# Altium project Voiture-Supercapa.PrjPcb
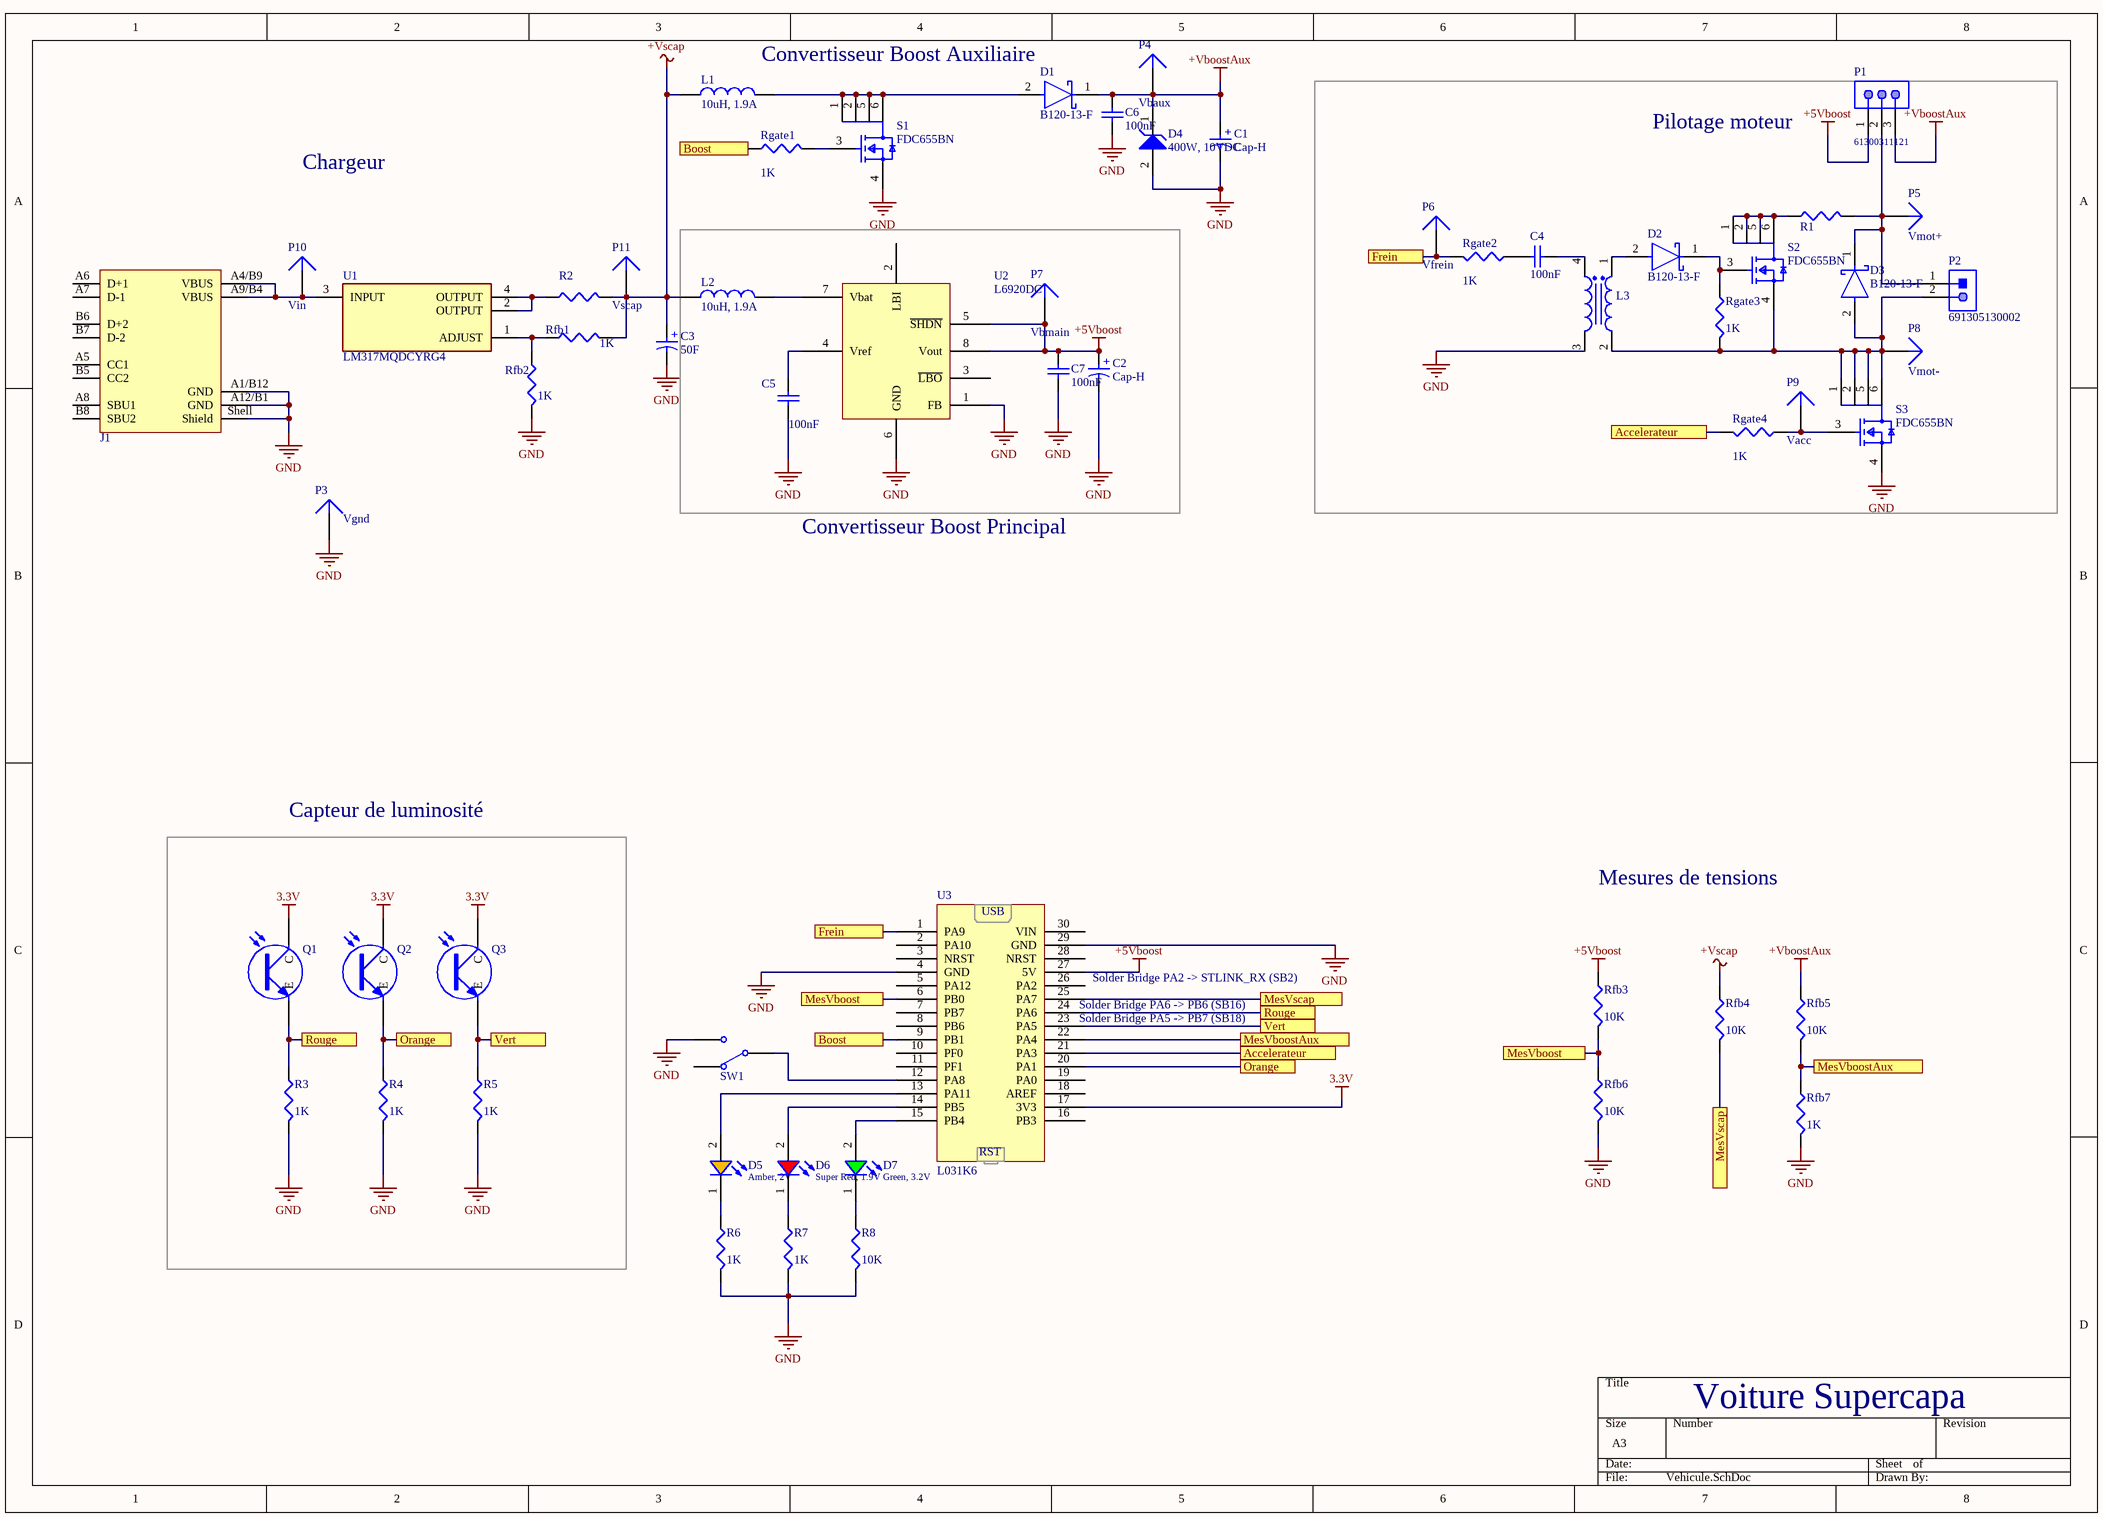
[diagram p0: Vehicule.SchDoc]
1 sheet, 58 parts. Net scope: flat (ports and power ports of the same name join across sheets).
Board file: Vehicule.PcbDoc

## Sheet Vehicule.SchDoc
size A3; SheetNumber: 1; SheetTotal: 1

### Parts
C1  Cap-H  [CAP-8x20]
C2  Cap-H  [CAP-8x20]
C3  50F  [SuperCap Couchee]
C4  100nF  [WCAP-CSGP_0805_L2W1.25H0.8_Reflow]
C5  100nF  [WCAP-CSGP_0805_L2W1.25H0.8_Reflow]
C6  100nF  [WCAP-CSGP_0805_L2W1.25H0.8_Reflow]
C7  100nF  [WCAP-CSGP_0805_L2W1.25H0.8_Reflow]
D1  B120-13-F  [FP-SMA-MFG]
D2  B120-13-F  [FP-SMA-MFG]
D3  B120-13-F  [FP-SMA-MFG]
D4  400W, 10VDC  [WE-TVSP_DO-214AC_Unidirectional]
D5  Amber, 2V  [WL-SMCW_0805]
D6  Super Red, 1.9V  [WL-SMCW_0805]
D7  Green, 3.2V  [WL-SMCW_0805]
J1  629722000214  [629722000214]  (value not drawn)
L1  10uH, 1.9A  [WE-PD_6033R]
L2  10uH, 1.9A  [WE-PD_6033R]
L3  10µH / 90µH  [WE-MTCI_5030]  (value not drawn)
P1  61300311121  [61300311121]
P2  691305130002  [691305130002]
P3  Vgnd  [PIN1]
P4  Vbaux  [PIN1]
P5  Vmot+  [PIN1]
P6  Vfrein  [PIN1]
P7  Vbmain  [PIN1]
P8  Vmot-  [PIN1]
P9  Vacc  [PIN1]
P10  Vin  [PIN1]
P11  Vscap  [PIN1]
Q1  1540032NA3090  [WL-TTRW_D3.85H5.3]  (value not drawn)
Q2  1540032NA3090  [WL-TTRW_D3.85H5.3]  (value not drawn)
Q3  1540032NA3090  [WL-TTRW_D3.85H5.3]  (value not drawn)
R1  3.3Ω  [WRIS-KSKE_2512_L6.3W3.2H0.6]  (value not drawn)
R2  3.3Ω  [WRIS-KSKE_2512_L6.3W3.2H0.6]  (value not drawn)
R3  value 1K  [R0805]  (hidden comment: RESISTOR 805)
R4  value 1K  [R0805]  (hidden comment: RESISTOR 805)
R5  value 1K  [R0805]  (hidden comment: RESISTOR 805)
R6  value 1K  [R0805]  (hidden comment: RESISTOR 805)
R7  value 1K  [R0805]  (hidden comment: RESISTOR 805)
R8  value 10K  [R0805]  (hidden comment: RESISTOR 805)
Rfb1  value 1K  [R0805]  (hidden comment: RESISTOR 805)
Rfb2  value 1K  [R0805]  (hidden comment: RESISTOR 805)
Rfb3  value 10K  [R0805]  (hidden comment: RESISTOR 805)
Rfb4  value 10K  [R0805]  (hidden comment: RESISTOR 805)
Rfb5  value 10K  [R0805]  (hidden comment: RESISTOR 805)
Rfb6  value 10K  [R0805]  (hidden comment: RESISTOR 805)
Rfb7  value 1K  [R0805]  (hidden comment: RESISTOR 805)
Rgate1  value 1K  [R0805]  (hidden comment: RESISTOR 805)
Rgate2  value 1K  [R0805]  (hidden comment: RESISTOR 805)
Rgate3  value 1K  [R0805]  (hidden comment: RESISTOR 805)
Rgate4  value 1K  [R0805]  (hidden comment: RESISTOR 805)
S1  FDC655BN  [FP-419BL-MFG]
S2  FDC655BN  [FP-419BL-MFG]
S3  FDC655BN  [FP-419BL-MFG]
SW1  450404015514  [450404015514]  (value not drawn)
U1  LM317MQDCYRG4  [FP-DCY0004A-IPC_B]
U2  L6920DC  [TSOP65P500X110-8N]
U3  L031K6  [STM-Nano]

### Blocks framed on the sheet
Pilotage moteur: C4 D2 D3 L3 P1 P2 P5 P6 P8 P9 R1 Rgate2-Rgate4 S2 S3
Capteur de luminosité: Q1-Q3 R3-R5

### Ports
Accelerateur, Boost, Frein, MesVboost, MesVboostAux, MesVscap, Orange, Rouge, Vert

### Nets
3.3V: Q1.1(C) Q2.1(C) Q3.1(C) U3.17(3V3)
+5Vboost: C2.1(P) C7.1 P1.1 P7.1 Rfb3.1 U2.5(~{SHDN}) U2.8(Vout) U3.27(5V)
+VboostAux: C1.1(P) C6.1 D1.1(C) D4.1(K) P1.3 P4.1 Rfb5.1
+Vscap: C3.1(P) L1.1 L2.1 P11.1 R2.2 Rfb1.2 Rfb4.1
GND: C1.2(N) C2.2(N) C3.2(N) C5.1 C6.2 C7.2 D4.2(A) J1.A1/B12(GND) J1.A12/B1(GND) J1.Shell(Shield) L3.3 P3.1 R3.2 R4.2 R5.2 R6.2 R7.2 R8.2 Rfb2.2 Rfb6.2 Rfb7.2 S1.4(S) S3.4(S) SW1.L2 U2.1(FB) U2.6(GND) U3.4(GND) U3.29(GND)
NetC4_1: C4.1 L3.4
NetC4_2: C4.2 Rgate2.1
NetC5_2: C5.2 U2.4(Vref)
NetD1_2: D1.2(A) L1.2 S1.1(D) S1.2(D) S1.5(D) S1.6(D)
NetD2_1: D2.1(C) Rgate3.1 S2.3(G)
NetD2_2: D2.2(A) L3.1
NetD3_1: D3.1(C) P1.2 P2.1 P5.1 R1.2
NetD3_2: D3.2(A) L3.2 P2.2 P8.1 Rgate3.2 S2.4(S) S3.1(D) S3.2(D) S3.5(D) S3.6(D)
NetD5_1: D5.1(K) R6.1
NetD5_2: D5.2(A) U3.13(PA11)
NetD6_1: D6.1(K) R7.1
NetD6_2: D6.2(A) U3.14(PB5)
NetD7_1: D7.1(K) R8.1
NetD7_2: D7.2(A) U3.15(PB4)
NetJ1_A4/B9: J1.A4/B9(VBUS) J1.A9/B4(VBUS) P10.1 U1.3(INPUT)
NetL2_2: L2.2 U2.7(Vbat)
NetP6_1: P6.1 Rgate2.2 U3.1(PA9) ; port Frein
NetP9_1: P9.1 Rgate4.1 S3.3(G)
NetQ1_2: Q1.2(E) R3.1 U3.24(PA6) ; port Rouge
NetQ2_2: Q2.2(E) R4.1 U3.20(PA1) ; port Orange
NetQ3_2: Q3.2(E) R5.1 U3.23(PA5) ; port Vert
NetR1_1: R1.1 S2.1(D) S2.2(D) S2.5(D) S2.6(D)
NetR2_1: R2.1 U1.2(OUTPUT) U1.4(OUTPUT)
NetRfb1_1: Rfb1.1 Rfb2.1 U1.1(ADJUST)
NetRfb3_2: Rfb3.2 Rfb6.1 U3.6(PB0) ; port MesVboost
NetRfb4_2: Rfb4.2 U3.25(PA7) ; port MesVscap
NetRfb5_2: Rfb5.2 Rfb7.1 U3.22(PA4) ; port MesVboostAux
NetRgate1_1: Rgate1.1 U3.9(PB1) ; port Boost
NetRgate1_2: Rgate1.2 S1.3(G)
NetRgate4_2: Rgate4.2 U3.21(PA3) ; port Accelerateur
NetSW1_COM: SW1.COM U3.12(PA8)

Not connected (* = marked no-connect by the designer): J1 A5(CC1) A6(D+1) A7(D-1) A8(SBU1) B5(CC2) B6(D+2) B7(D-2) B8(SBU2); SW1 L1; U2 2(LBI) 3(~{LBO}); U3 2(PA10) 3(NRST) 5(PA12) 7(PB7) 8(PB6) 10(PF0) 11(PF1) 16(PB3) 18(AREF) 19(PA0) 26(PA2) 28(NRST) 30(VIN)

### Notes on the sheet
- Convertisseur Boost Auxiliaire
- Chargeur
- Convertisseur Boost Principal
- Mesures de tensions
- (near U3) Solder Bridge PA2 -> STLINK_RX (SB2)
- (near U3) Solder Bridge PA6 -> PB6 (SB16)
- (near U3) Solder Bridge PA5 -> PB7 (SB18)
- Voiture Supercapa
- (in symbol 850617022002) +
- (in symbol CAP-WE-8X20H) +
- (in symbol STM32-NUCLEO-L031K6) USB; RST

### Library data of the parts
C1 C2 = CAP-WE-8X20H: Capacitor 8x20 H; Manufacturer Part Number: 850617022002; Manufacturer: Wurth Elektronik; Match Code: WCAP-STSC; Capacitance: 50F; Capacitance Tolerance: -10% / +30%; Discharge Current Max: 33.7A; Energy Density: 4.5Wh/kg; ESR (AC): 15mΩ; ESR (DC): 20mΩ; Leakage Current: 0.105mA; Pitch: 7.5mm; Power Density: 8.13kW/kg; Rated Discharge Current: 11.2A; Rated Voltage (DC): 2.7V; Category: Super Capacitors (EDLCs); ComponentLink1Description: Website Link; ComponentLink1URL: https://www.we-online.com/redexpert/article/850617022002?ad; ComponentLink2Description: Datasheet Link; ComponentLink2URL: https://www.we-online.com/redexpert/spec/850617022002?ad; Mount: Through Hole; Operating Temperature Max: 65°C; Operating Temperature Min: -40°C; Packaging: Bag; Height: 40mm; Diameter: 18mm; Life Cycle: 500000Cycles
C3 = 850617022002: WCAP-STSC Supercapacitors (EDLCs), THT, D18 x H40mm, 50F, 2.7VDC; Manufacturer: Wurth Elektronik; Capacitance Tolerance: -10% / +30%; Discharge Current Max: 33.7A; Energy Density: 4.5Wh/kg; ESR (AC): 15mΩ; ESR (DC): 20mΩ; Leakage Current: 0.105mA; Pitch: 7.5mm; Power Density: 8.13kW/kg; Rated Discharge Current: 11.2A; Rated Voltage (DC): 2.7V; Manufacturer Part Number: 850617022002; Category: Super Capacitors (EDLCs); Match Code: WCAP-STSC; ComponentLink1Description: Website Link; ComponentLink1URL: https://www.we-online.com/redexpert/article/850617022002?ad; ComponentLink2Description: Datasheet Link; ComponentLink2URL: https://www.we-online.com/redexpert/spec/850617022002?ad; Mount: Through Hole; Operating Temperature Max: 65°C; Operating Temperature Min: -40°C; Packaging: Bag; Height: 40mm; Diameter: 18mm; Capacitance: 50F; Life Cycle: 500000Cycles
C4 C6 C7 = 885012207072: WCAP-CSGP Multilayer Ceramic Chip Capacitor, General Purpose, size 0805, X7R, 100nF, 25VDC; Manufacturer: Wurth Elektronik; Case/Size Code: 0805; Capacitance: 470nF; Capacitance Tolerance: +/-10%; Dissipation Factor: 3.5%; Insulation Resistance: 5GΩ; Rated Voltage (DC): 25V; Technical Reference: X7R0805104K025DFCT10000; Manufacturer Part Number: 885012207072; Category: Multilayer Ceramic Chip Capacitors; Match Code: WCAP-CSGP; ComponentLink1Description: Website Link; ComponentLink1URL: https://www.we-online.com/redexpert/article/885012207072?ad; ComponentLink2Description: Datasheet Link; ComponentLink2URL: https://www.we-online.com/redexpert/spec/885012207072?ad; Mount: Surface Mount; Operating Temperature Max: 125°C; Operating Temperature Min: -55°C; Packaging: Tape and Reel; Length: 2mm; Width: 1.25mm; Height: 0.8mm; Ceramic Type: X7R
C5 = 885012207072: WCAP-CSGP Multilayer Ceramic Chip Capacitor, General Purpose, size 0805, X7R, 100nF, 25VDC; Manufacturer: Wurth Elektronik; Case/Size Code: 0805; Capacitance Tolerance: +/-10%; Dissipation Factor: 3.5%; Insulation Resistance: 5GΩ; Rated Voltage (DC): 25V; Technical Reference: X7R0805104K025DFCT10000; Manufacturer Part Number: 885012207072; Category: Multilayer Ceramic Chip Capacitors; Match Code: WCAP-CSGP; ComponentLink1Description: Website Link; ComponentLink1URL: https://www.we-online.com/redexpert/article/885012207072?ad; ComponentLink2Description: Datasheet Link; ComponentLink2URL: https://www.we-online.com/redexpert/spec/885012207072?ad; Mount: Surface Mount; Operating Temperature Max: 125°C; Operating Temperature Min: -55°C; Packaging: Tape and Reel; Length: 2mm; Width: 1.25mm; Height: 0.8mm; Capacitance: 100nF; Ceramic Type: X7R
D1-D3 = CMP-12790-000051-1: DIODE SCHOTTKY 20V 1A SMA; Manufacturer: Diodes Inc.; Value: 110pF; Standoff Height: 0.05mm; Max Junction Temp: +150°C; Max Surge Forward Current: 30A; Peak Reverse Current: 0.5mA; Height: 2.4mm; Temperature Range High: +150°C; Category: Diode; ComponentLink2Description: Datasheet; Forward Current: 1A; Device Class L1: Discrete Semiconductors; Footprint Url: https://www.diodes.com/assets/Package-Files/SMA.pdf; Device Class L3: Schottky Diodes; Reverse Voltage: 20V; Mouser Description: Schottky Diodes & Rectifiers 20V 1A; Temperature Range Low: -65°C; Automotive: No; Octopart: https://octopart.com/b120-13-f-diodes+inc.-40148653; Digikey Description: DIODE SCHOTTKY 20V 1A SMA; RoHS: TRUE; Lead Free: Yes; Manufacturer Part Number: B120-13-F; Package: SMA; Temperature: -65°C to +150°C; Capacitance: 110pF; Max Repetitive Reverse Voltage: 20V; ComponentLink2URL: https://www.diodes.com/assets/Datasheets/ds13002.pdf; Device Class L2: Diodes
D4 = 824500101: WE-TVSP SMT Power TVS Diode, DO-214AC, 400W, 10VDC, Unidirectional; Manufacturer: Wurth Elektronik; (Reverse) Breakdown Voltage: 11.7V; (Reverse) Peak Pulse Current: 23.5A; Clamping Voltage: 17V; DC Operating Voltage: 10V; ComponentLink1Description: Manufacturer; Mounting Technology: SMT; Operating Temperature: -65 to +150degC; Packaging: Tape and Reel; ComponentLink2URL: https://www.we-online.com/catalog/datasheet/824500101.pdf; ComponentLink2Description: Datasheet; Manufacturer Part Number: 824500101; Polarity: Unidirectional; ComponentLink1URL: http://www.we-online.de; Published Date: July 2020; Size: DO-214AC; Power Dissipation: 400W
D5 = 150080AS75000: WL-SMCW SMT Mono-color Chip LED Waterclear, size 0805, Amber, 2V, 140deg; Manufacturer: Wurth Elektronik; Chip Technology: AlInGaP; Dominant Wavelength typ.: 605nm; Luminous Intensity typ.: 130mcd; Peak Wavelength typ.: 610nm; Viewing Angle: 140deg; ComponentLink1Description: Manufacturer; ComponentLink1URL: http://www.we-online.de; ComponentLink2URL: https://www.we-online.com/catalog/datasheet/150080AS75000.pdf; ComponentLink2Description: Datasheet; Forward Voltage typ.: 2V; Emitting Color: Amber; Mounting Technology: SMT; Operating Temperature: -40 to +85degC; Published Date: December 2019; Part Number: 150080AS75000; Packaging: Tape and Reel; Size: 0805; Publisher: Wurth Elektronik; Manufacturer Part Number: 150080AS75000
D6 = 150080SS75000: WL-SMCW SMT Mono-color Chip LED Waterclear, size 0805, Super Red, 1.9V, 140deg; Manufacturer: Wurth Elektronik; Chip Technology: AlInGaP; Dominant Wavelength typ.: 630nm; Luminous Intensity typ.: 60mcd; Peak Wavelength typ.: 645nm; Viewing Angle: 140deg; ComponentLink1Description: Manufacturer; ComponentLink1URL: http://www.we-online.de; ComponentLink2URL: https://www.we-online.com/catalog/datasheet/150080SS75000.pdf; ComponentLink2Description: Datasheet; Forward Voltage typ.: 1.9V; Emitting Color: Super Red; Mounting Technology: SMT; Operating Temperature: -40 to +85degC; Published Date: December 2019; Part Number: 150080SS75000; Packaging: Tape and Reel; Size: 0805; Publisher: Wurth Elektronik; Manufacturer Part Number: 150080SS75000
D7 = 150080GS75000: WL-SMCW SMT Mono-color Chip LED Waterclear, size 0805, Green, 3.2V, 140deg; Manufacturer: Wurth Elektronik; Chip Technology: InGaN; Dominant Wavelength typ.: 525nm; Luminous Intensity typ.: 450mcd; Peak Wavelength typ.: 515nm; Viewing Angle: 140deg; ComponentLink1Description: Manufacturer; ComponentLink1URL: http://www.we-online.de; ComponentLink2URL: https://www.we-online.com/catalog/datasheet/150080GS75000.pdf; ComponentLink2Description: Datasheet; Forward Voltage typ.: 3.2V; Emitting Color: Green; Mounting Technology: SMT; Operating Temperature: -40 to +85degC; Published Date: December 2019; Part Number: 150080GS75000; Packaging: Tape and Reel; Size: 0805; Publisher: Wurth Elektronik; Manufacturer Part Number: 150080GS75000
J1 = 629722000214: WR-USB 2.0 Type C, Receptacle, Horizontal, SMT; Manufacturer: Wurth Elektronik; Interface Type: Type C; Number of Ports: 1; Rated Current: 5A; Working Voltage: 20VAC; ComponentLink1Description: Website Link; ComponentLink1URL: https://www.we-online.com/redexpert/article/629722000214?ad; ComponentLink2Description: Datasheet Link; ComponentLink2URL: https://www.we-online.com/redexpert/spec/629722000214?ad; Manufacturer Part Number: 629722000214; Category: Input/Output Connectors; Match Code: WR-USB; Mount: Surface Mount; Operating Temperature Max: 85°C; Operating Temperature Min: -40°C; Packaging: Tape and Reel; Application: USB 2.0; Gender: Receptacle; Number of Pins: 16; Orientation: Horizontal
L1 L2 = 744778510: WE-PD SMT Power Inductor, size 6033R, 10uH, 1.9A; Manufacturer: Wurth Elektronik; Self Resonant Frequency: 37MHz; DC Resistance typ.: 100mOhm; DC Resistance max.: 125mOhm; Saturation Current: 1.6A; Type: Robust; ComponentLink1Description: Manufacturer; ComponentLink1URL: http://www.we-online.de; ComponentLink2Description: Datasheet; ComponentLink2URL: https://www.we-online.com/catalog/datasheet/744778510.pdf; Mounting Technology: SMT; Operating Temperature: -40 to +125degC; Packaging: Tape and Reel; Published Date: April 2020; Inductance: 10uH; Manufacturer Part Number: 744778510; Rated Current: 1.9A; Size: 6033R
L3 = 744889030100: WE-MTCI SMT Multi-Turn Ratio coupled Inductor, size 5030, 1:3, 10µH / 90µH, 0.95A; Manufacturer: Wurth Elektronik; Case/Size Code: 5030; DC Resistance 1: 0.363Ω; DC Resistance 2: 0.846Ω; DC Resistance Max 1: 0.5Ω; DC Resistance Max 2: 1.1Ω; Rated Voltage: 80V; Saturation Current: 1.5A; Self Resonant Frequency: 8MHz; Manufacturer Part Number: 744889030100; Category: Coupled Power Inductors; Match Code: WE-MTCI; ComponentLink1Description: Website Link; ComponentLink1URL: https://www.we-online.com/redexpert/article/744889030100?ad; ComponentLink2Description: Datasheet Link; ComponentLink2URL: https://www.we-online.com/redexpert/spec/744889030100?ad; Mount: Surface Mount; Operating Temperature Max: 125°C; Operating Temperature Min: -40°C; Packaging: Tape and Reel; Length: 5.2mm; Width: 5.2mm; Height: 3.1mm; Inductance 1: 10µH; Inductance 2: 90µH; Rated Current: 0.95A; Turns Ratio: 1:3
P1 = 61300311121: WR-PHD Pin Header, THT, pitch 2.54mm, Single Row, Vertical, 3p; Manufacturer: Wurth Elektronik; Pin Number: 3; Rated Current: 3A; Working Voltage: 250VAC; Withstanding Voltage: 500VAC; Contact Resistance: 20mOhm; ComponentLink1Description: Manufacturer; ComponentLink1URL: http://www.we-online.de; ComponentLink2Description: Datasheet; ComponentLink2URL: https://www.we-online.com/catalog/datasheet/61300311121.pdf; Manufacturer Part Number: 61300311121; Published Date: May 2020; Pitch: 2.54mm; Operating Temperature: -40 to +105degC; Mounting Technology: THT; Packaging: Bag; Gender: Pin Header; Row Number: Single; Orientation: Vertical
P2 = 691305130002: WR-TBL Serie 3051 Vertical PCB Header, Pluggable, pitch 3.5mm, 2p; Manufacturer: Wurth Elektronik; Compliance: Lead free / RoHS; Modularity: No; Pin Number: 2; Rated Current [UL]: 12A; Working Voltage [UL]: 300VAC; ComponentLink1Description: Manufacturer; ComponentLink1URL: http://www.we-online.de; ComponentLink2URL: https://katalog.we-online.de/em/datasheet/691305130002.pdf; ComponentLink2Description: Datasheet; Mounting Technology: THT; Part Number: 691305130002; Packaging: Box; Operating Temperature: -40 to +105degC; PCB/Cable/Panel: PCB; Pitch: 3.5mm; Published Date: October 2019; Type: Vertical; Publisher: Wurth Elektronik; Application: Pluggable; Manufacturer Part Number: 691305130002
P3-P11 = Plug: Manufacturer: GENERIC; Manufacturer Part Number: NC; LatestRevisionDate: 17-Jul-2002; LatestRevisionNote: Re-released for DXP Platform.; Publisher: Altium Limited
Q1-Q3 = 1540032NA3090: WL-TTRW THT Phototransistor Round Waterclear, D3.85H5.3mm, 400-1100nm, 5mA, 30°; Manufacturer: Wurth Elektronik; Chip Technology: Si; Collector Current Min: 15mA; Collector-Emitter Dark Current: 300nA; Polarity: NPN Phototransistor; Range of Spectral Bandwidth Min: 400nm; Range of Spectral Bandwidth Max: 1100nm; Wavelength of Peak Sensitivity: 850nm; ComponentLink1Description: Website Link; ComponentLink1URL: https://www.we-online.com/redexpert/article/1540032NA3090?ad; ComponentLink2Description: Datasheet Link; ComponentLink2URL: https://www.we-online.com/redexpert/spec/1540032NA3090?ad; Manufacturer Part Number: 1540032NA3090; Category: Phototransistors; Match Code: WL-TTRW; Mount: Through Hole; Operating Temperature Max: 85°C; Operating Temperature Min: -40°C; Packaging: Bulk; Height: 5.3mm; Diameter: 3.85mm; Collector Current: 5mA; Viewing Angle: 30°
R1 R2 = 560050363012: WRIS-KSKE Thick Film Resistor, SMT, size 2512, 1W, 3.3Ω, +/-1%; Manufacturer: Wurth Elektronik; Case/Size Code: 2512; Rated Current: 0.55A; Technical Reference: KE25123R30F101KAATE0000; Temperature Coefficient of Resistance: +/-100ppm/°C; Manufacturer Part Number: 560050363012; Category: Thick Film Resistors; Match Code: WRIS-KSKE; ComponentLink1Description: Website Link; ComponentLink1URL: https://www.we-online.com/redexpert/article/560050363012?ad; ComponentLink2Description: Datasheet Link; ComponentLink2URL: https://www.we-online.com/redexpert/spec/560050363012?ad; Mount: Surface Mount; Operating Temperature Max: 155°C; Operating Temperature Min: -55°C; Packaging: Tape and Reel; Length: 6.3mm; Width: 3.2mm; Height: 0.6mm; Rated Power: 1W; Resistance: 3.3Ω; Resistance Tolerance: +/-1%
R3-R7 Rfb1 Rfb2 Rfb7 Rgate1-Rgate4 = R0805: Resistor; Manufacturer: GENERIC; Manufacturer Part Number: RESISTANCE-0805-1K; Published: 8-Jun-2000; LatestRevisionDate: 29-May-2009; LatestRevisionNote: IPC-7351 Footprint Added.; PackageReference: J1-0603; Publisher: Altium Limited; PackageDescription: Chip Resistor
R8 Rfb3-Rfb6 = R0805: Resistor; Manufacturer: GENERIC; Manufacturer Part Number: RESISTANCE-0805-10K; Published: 8-Jun-2000; LatestRevisionDate: 29-May-2009; LatestRevisionNote: IPC-7351 Footprint Added.; PackageReference: J1-0603; Publisher: Altium Limited; PackageDescription: Chip Resistor
S1-S3 = CMP-07173-000072-1: MOSFET N-CH 30V 6.3A SSOT-6; Manufacturer: ON Semiconductor; Turn Off Delay Time: 15ns; Gate To Source Voltage: 20V; Threshold Vgs Min: 1V; Gate Charge At Vgs: 9nC @ 10V; Max Forward Diode Voltage: 1.2V; Number Of Channels: 1; Power Dissipation: 0.8W; Turn On Delay Time: 6ns; Standoff Height: 0mm; Reverse Recovery Charge: 4nC; Pulse Drain Current: 20A; Max Junction Temp: +150°C; Drain To Source Resistance: 21mΩ; Depletion Mode: False; Threshold Vgs Max: 3V; Rthja Max: 78°C/W; Input Capacitace At Vds: 470pF @ 15V; Typ Forward Diode Voltage: 0.8V; Transconductance: 35S; ComponentLink2Description: Datasheet; Octopart: https://octopart.com/fdc655bn-on+semiconductor-84325765; Drain To Source Voltage: 30V; Device Class L2: Transistors; Height: 1.1mm; Temperature Range High: +150°C; Footprint Url: https://www.onsemi.com/pub/Collateral/419BL.PDF; Continuous Drain Current: 6.3A; Package: 419BL; RoHS: TRUE; Drain To Source Breakdown Voltage: 30V; Mouser Description: MOSFET SINGLE NCH LOG LVEL PWR TRENCH MOSFET; Temperature Range Low: -55°C; Number Of N Channels: 1; Lead Free: Yes; Temperature: -55°C to +150°C; Device Class L1: Discrete Semiconductors; Category: Trans; Manufacturer Part Number: FDC655BN; ComponentLink2URL: https://www.onsemi.com/pub/Collateral/FDC655BN-D.PDF; Automotive: No; Device Class L3: MOSFETs; Digikey Description: MOSFET N-CH 30V 6.3A SSOT-6; Reverse Recovery Time: 15ns
SW1 = 450404015514: WS-SLSU Mini Slide Switch, Same Side Connection Side Push, SPDT, 5VDC, 300mA, 240g; Manufacturer: Wurth Elektronik; ComponentLink1Description: Website Link; ComponentLink1URL: https://www.we-online.com/redexpert/article/450404015514?ad; ComponentLink2Description: Datasheet Link; ComponentLink2URL: https://www.we-online.com/redexpert/spec/450404015514?ad; Manufacturer Part Number: 450404015514; Category: Slide Switches; Match Code: WS-SLSU; Mount: Surface Mount; Operating Temperature Max: 85°C; Operating Temperature Min: -40°C; Packaging: Tape and Reel; Length: 6.7mm; Width: 2.7mm; Height: 1.1mm; Circuit: SPDT; Contact Material: Copper Alloy; Contact Plating: Silver; Operation Force: 240g; Rated Current: 300mA; Rated Voltage: 5VDC; Terminal Material: Copper Alloy; Terminal Plating: Silver
U1 = CMP-04917-000117-1: IC REG LIN POS ADJ 500MA SOT223; Manufacturer: TEXAS INSTRUMENTS; Polarity: Positive; Max Input Voltage: 40V; Power Supply Rejection Ratio (PSRR): 80dB; Quiescent Current: 3.5mA; Number of Regulators: 1; Output Voltage: 37V; Min Input Voltage: 3V; Reference Voltage: 1.3V; Dropout Voltage: 2V; Output Type: Adjustable; RoHS Compliant: Yes; Max Operating Temperature: 125°C; Packaging: Tape and Reel; Radiation Hardening: No; Max Output Current: 500mA; Number of Outputs: 1; Width: 3.5mm; Height: 1.6mm; Contact Plating: Gold; Length: 6.5mm; Series: -; Package Quantity: 1; Mount: Surface Mount; Lead Free: Lead Free; Min Current Limit: 500mA; Min Operating Temperature: -40°C; Case/Package: SOT-223-4; Output Current: 500mA; Manufacturer Part Number: LM317MQDCYRG4
U2 = L6920DC: Manufacturer: STMICROELECTRONICS; Manufacturer Part Number: L6920DC
U3 = STM32-NUCLEO-L031K6: STM32 Nucleo-32 development board with STM32L031K6 MCU, supports Arduino nano connectivity NUCLEO-L031K6; Manufacturer: STMICROELECTRONICS; Manufacturer Part Number: NUCLEO-L031K6

## Assembly variants
Voiture-Supercapa-mini-sans-frein: not fitted C1 C4 C6 D1 D2 D4 L1 L3 P3 P4 P5 P6 P7 P8 P9 P10 P11 R1 Rgate1 Rgate2 Rgate3 S1 S2